# Altium schematic sheet Power.SchDoc: DARKYDEN_POWER
size Letter; ApprovedBy: APPROUVÉ PAR; Author: Harold Malbrouck; Organization: Cegep Limoilou; Address1: 1300, 8e Avenue; Address2: Québec, QC; Address3: Canada; Address4: G1J 5L5; Revision: Rev.A; SheetNumber: 8; SheetTotal: 22
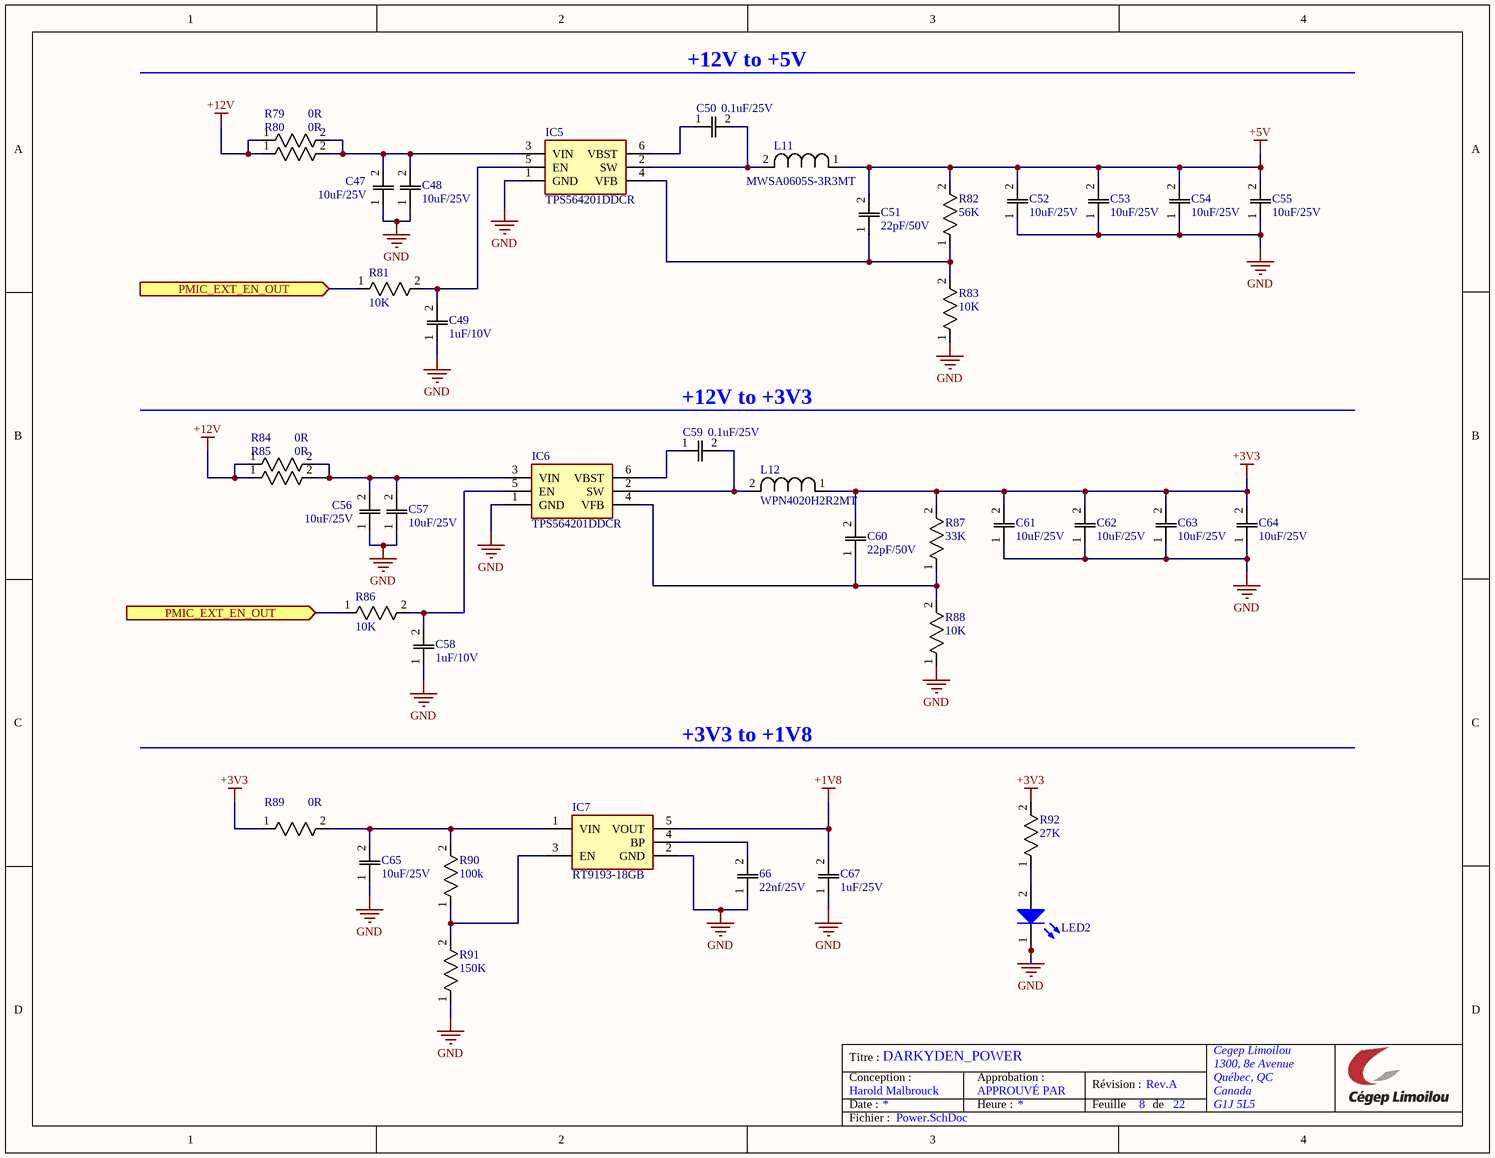
[diagram p0: Power.SchDoc]

## Parts
66  22nf/25V  [C0805]
C47  10uF/25V  [CAPC220145_88N_KEM]
C48  10uF/25V  [CAPC220145_88N_KEM]
C49  1uF/10V  [CAPC220145_88N_KEM]
C50  0.1uF/25V  [CAPC220145_88N_KEM]
C51  22pF/50V  [CAPC220145_88N_KEM]
C52  10uF/25V  [CAPC220145_88N_KEM]
C53  10uF/25V  [CAPC220145_88N_KEM]
C54  10uF/25V  [CAPC220145_88N_KEM]
C55  10uF/25V  [CAPC220145_88N_KEM]
C56  10uF/25V  [CAPC220145_88N_KEM]
C57  10uF/25V  [CAPC220145_88N_KEM]
C58  1uF/10V  [CAPC220145_88N_KEM]
C59  0.1uF/25V  [CAPC220145_88N_KEM]
C60  22pF/50V  [CAPC220145_88N_KEM]
C61  10uF/25V  [CAPC220145_88N_KEM]
C62  10uF/25V  [CAPC220145_88N_KEM]
C63  10uF/25V  [CAPC220145_88N_KEM]
C64  10uF/25V  [CAPC220145_88N_KEM]
C65  10uF/25V  [CAPC220145_88N_KEM]
C67  1uF/25V  [C0805]
IC5  TPS564201DDCR  [SOT95P280X110-6N]
IC6  TPS564201DDCR  [SOT95P280X110-6N]
IC7  RT9193-18GB  [SOT94P279X130-5N]
L11  MWSA0605S-3R3MT  [IND_MWSA0603S_SNL]
L12  WPN4020H2R2MT  [IND_WPN4020H_SNL]
LED2  Blue, 3.2V, 140°  [WL-SMCD_0603]  (value not drawn)
R79  0R  [ERJ3EKF1000V]
R80  0R  [ERJ3EKF1000V]
R81  10K  [ERJ3EKF1000V]
R82  56K  [RESC1608X55N]
R83  10K  [ERJ3EKF1000V]
R84  0R  [ERJ3EKF1000V]
R85  0R  [ERJ3EKF1000V]
R86  10K  [ERJ3EKF1000V]
R87  33K  [ERJ3EKF1000V]
R88  10K  [ERJ3EKF1000V]
R89  0R  [ERJ3EKF1000V]
R90  100k  [ERJ3EKF1000V]
R91  150K  [ERJ3EKF1000V]
R92  27K  [RC0603N_PAN]

## Ports
PMIC_EXT_EN_OUT (in, see CONNECTEUR_1[1B], Power[1A], POWER_PCie[1B], POWER_PCie[1C]), PMIC_EXT_EN_OUT (in, see CONNECTEUR_1[1B], Power[1C], POWER_PCie[1B], POWER_PCie[1C])

## Nets
+1V8: C67.2 IC7.5(VOUT)
+3V3: C60.2 C61.2 C62.2 C63.2 C64.2 L12.1 R87.2 R89.1 R92.2
+5V: C51.2 C52.2 C53.2 C54.2 C55.2 L11.1 R82.2
+12V: R79.1 R80.1 R84.1 R85.1
GND: 66.1 C47.1 C48.1 C49.1 C52.1 C53.1 C54.1 C55.1 C56.1 C57.1 C58.1 C61.1 C62.1 C63.1 C64.1 C65.1 C67.1 IC5.1(GND) IC6.1(GND) IC7.2(GND) LED2.1(K) R83.1 R88.1 R91.1
PMIC_EXT_EN_OUT: R81.1 R86.1 ; port PMIC_EXT_EN_OUT
Net66_2: 66.2 IC7.4(BP)
NetC47_2: C47.2 C48.2 IC5.3(VIN) R79.2 R80.2
NetC49_2: C49.2 IC5.5(EN) R81.2
NetC50_1: C50.1 IC5.6(VBST)
NetC50_2: C50.2 IC5.2(SW) L11.2
NetC51_1: C51.1 IC5.4(VFB) R82.1 R83.2
NetC56_2: C56.2 C57.2 IC6.3(VIN) R84.2 R85.2
NetC58_2: C58.2 IC6.5(EN) R86.2
NetC59_1: C59.1 IC6.6(VBST)
NetC59_2: C59.2 IC6.2(SW) L12.2
NetC60_1: C60.1 IC6.4(VFB) R87.1 R88.2
NetC65_2: C65.2 IC7.1(VIN) R89.2 R90.2
NetIC7_3: IC7.3(EN) R90.1 R91.2
NetLED2_2: LED2.2(A) R92.1

## Notes on the sheet
- +12V to +5V
- (near C59) +12V to +3V3
- +3V3 to +1V8
- Titre :
- Conception :
- Date :
- Approbation :
- Heure :
- Révision :
- Feuille
- de
- Fichier :

## Library data of the parts
66 = C0805C223J3GACTU: 22nF, 25 V, 0805 [2012 Metric], 5%, C0G / NP0; Manufacturer_Name: KEMET; Dielectric Material: 4241ConductorMaterial; Voltage Rating: 25V; Dissipation Factor: 0.1%; Temperature Coefficient: 30ppm/°C; Datasheet Link: https://content.kemet.com/datasheets/KEM_C1003_C0G_SMD.pdf; Height: 1.1mm; Manufacturer_Part_Number: C0805C223J3GACTU; Supplier: Digikey; Supplier Part Number: 399-C0805C223J3GACTUCT-ND; Manufacturer: KEMET; Manufacturer Part Number: C0805C223J3GACTU; RoHS: Yes; Category: Ceramic Capacitors; Mounting Technology: Surface Mount; Case/Package: 0805; Case Code (Imperial): 0805; Case Code (Metric): 2012; Material: 4241ConductorMaterial; Min Operating Temperature: -55°C; Max Operating Temperature: 125°C; Value: 22nF; Tolerance: 5%; Packaging: Tape and Reel; Voltage Rating (DC): 25V; Package Quantity: 4000; Dielectric: C0G; Termination: SMD/SMT; Voltage: 25V; Series: SMD Comm C0G; Construction: Flat; Length: 2mm; Width: 1.2mm; Thickness: 0.039inch; Depth: 1.25mm; Radiation Hardening: No; Reach SVHC Compliant: No; RoHS Compliant: Yes; Lead Free: 5697LeadFree; ComponentLink1URL: http://www.farnell.com/datasheets/2741014.pdf?src-supplier=Farnell; ComponentLink1Description: http://www.farnell.com/datasheets/2741014.pdf?src-supplier=Farnell; ComponentLink2URL: http://components.arrow.com/part/dataview/46124259S8614547N7429?src-supplier=Arrow+Electronics; ComponentLink2Description: http://components.arrow.com/part/dataview/46124259S8614547N7429?src-supplier=Arrow+Electronics; ComponentLink3URL: http://www.mouser.com/ds/2/212/KEM_C1003_C0G_SMD-1101588.pdf?src-supplier=Mouser; ComponentLink3Description: http://www.mouser.com/ds/2/212/KEM_C1003_C0G_SMD-1101588.pdf?src-supplier=Mouser; ComponentLink4URL: http://www.kemet.com/docfinder?Partnumber=C0805C223J3GACTU&src-supplier=Digikey; ComponentLink4Description: http://www.kemet.com/docfinder?Partnumber=C0805C223J3GACTU&src-supplier=Digikey; ComponentLink5URL: http://www.farnell.com/datasheets/2741014.pdf?src-supplier=Newark; ComponentLink5Description: http://www.farnell.com/datasheets/2741014.pdf?src-supplier=Newark; ComponentLink6URL: https://www.verical.com/server-webapp/html/getDatasheet?partID=512137&src-supplier=Verical; ComponentLink6Description: https://www.verical.com/server-webapp/html/getDatasheet?partID=512137&src-supplier=Verical; ComponentLink7URL: http://www.farnell.com/datasheets/2741014.pdf?src-supplier=Element14; ComponentLink7Description: http://www.farnell.com/datasheets/2741014.pdf?src-supplier=Element14; ComponentLink8URL: https://datasheet.octopart.com/C0805C223J3GACTU-KEMET-datasheet-176142324.pdf?src-supplier=Element14; ComponentLink8Description: https://datasheet.octopart.com/C0805C223J3GACTU-KEMET-datasheet-176142324.pdf?src-supplier=Element14; ComponentLink9URL: http://capacitoredge.kemet.com/capedge2/DataSheet?pn=C0805C223J3GACTU&src-supplier=Avnet; ComponentLink9Description: http://capacitoredge.kemet.com/capedge2/DataSheet?pn=C0805C223J3GACTU&src-supplier=Avnet; ComponentLink10URL: https://api.kemet.com/component-edge/download/datasheet/C0805C223J3GACTU.pdf?src-supplier=Digi-Key; ComponentLink10Description: https://api.kemet.com/component-edge/download/datasheet/C0805C223J3GACTU.pdf?src-supplier=Digi-Key; ComponentLink11URL: https://datasheet.octopart.com/C0805C223J3GACTU-Kemet-datasheet-14356739.pdf?src-supplier=Newark; ComponentLink11Description: https://datasheet.octopart.com/C0805C223J3GACTU-Kemet-datasheet-14356739.pdf?src-supplier=Newark; ComponentLink12URL: https://datasheet.octopart.com/C0805C223J3GACTU-KEMET-datasheet-37178240.pdf?src-supplier=Electro+Sonic; ComponentLink12Description: https://datasheet.octopart.com/C0805C223J3GACTU-KEMET-datasheet-37178240.pdf?src-supplier=Electro+Sonic
C47 C48 C52-C57 C61-C65 = C0805C106K3PACTU: 10uF / 25 VDC, +85degC, X5R Dielec, +/-10% | KEMET C0805C106K3PACTU 0805; Dielectric Material: Ceramic; Material: 4241ConductorMaterial; Voltage Rating: 25V; Dissipation Factor: 10%; Mfr_Name: Kemet; Supplier: Digikey; Supplier Part Number: 399-11939-1-ND; Manufacturer: KEMET; Manufacturer Part Number: C0805C106K3PACTU; RoHS: Yes; Category: Ceramic Capacitors; Case/Package: 0805; Case Code (Metric): 2012; Case Code (Imperial): 0805; Min Operating Temperature: -55°C; Max Operating Temperature: 85°C; Dielectric: X5R; Packaging: Cut Tape; Voltage: 25V; Termination: Solder; Tolerance: 10%; Value: 10uF; Series: SMD Comm X5R; Voltage Rating (DC): 25V; Length: 2mm; Height: 1.25mm; Depth: 1.25mm; Reach SVHC Compliant: No; RoHS Compliant: Yes; Lead Free: 5697LeadFree; ComponentLink1URL: http://www.farnell.com/datasheets/2741185.pdf?src-supplier=Farnell; ComponentLink1Description: http://www.farnell.com/datasheets/2741185.pdf?src-supplier=Farnell; ComponentLink2URL: http://www.alliedelec.com/m/d/f3c02ddb98afa3dd1adcb801109671e9.pdf?src-supplier=Allied+Electronics; ComponentLink2Description: http://www.alliedelec.com/m/d/f3c02ddb98afa3dd1adcb801109671e9.pdf?src-supplier=Allied+Electronics; ComponentLink3URL: https://api.kemet.com/component-edge/download/datasheet/C0805C106K3PAC7800.pdf?src-supplier=Digikey; ComponentLink3Description: https://api.kemet.com/component-edge/download/datasheet/C0805C106K3PAC7800.pdf?src-supplier=Digikey; ComponentLink4URL: http://www.kemet.com/Lists/ProductCatalog/Attachments/19/KEM_C1006_X5R_SMD.pdf?src-supplier=Avnet; ComponentLink4Description: http://www.kemet.com/Lists/ProductCatalog/Attachments/19/KEM_C1006_X5R_SMD.pdf?src-supplier=Avnet; ComponentLink5URL: http://www.farnell.com/datasheets/2741185.pdf?src-supplier=Element14; ComponentLink5Description: http://www.farnell.com/datasheets/2741185.pdf?src-supplier=Element14; ComponentLink6URL: http://www.farnell.com/datasheets/2741185.pdf?src-supplier=Newark; ComponentLink6Description: http://www.farnell.com/datasheets/2741185.pdf?src-supplier=Newark; ComponentLink7URL: https://datasheet.octopart.com/C0805C106K3PACTU-Kemet-datasheet-46909776.pdf?src-supplier=Element14; ComponentLink7Description: https://datasheet.octopart.com/C0805C106K3PACTU-Kemet-datasheet-46909776.pdf?src-supplier=Element14
C49 C58 = C0805C105K8RACTU: Multilayer Ceramic Capacitors MLCC - SMD/SMT 10V 1uF X7R 0805 10%; Mfr_Name: Kemet; Material: 4241ConductorMaterial; Dissipation Factor: 5%; Supplier: Digikey; Supplier Part Number: 399-C0805C105K8RACTUCT-ND; Manufacturer: KEMET; Manufacturer Part Number: C0805C105K8RACTU; RoHS: Yes; Category: Ceramic Capacitors; Stock: 113387; Pricing: 1=0.2, 10=0.112, 100=0.0701, 1000=0.04837 (USD); Mounting Technology: Surface Mount; Case/Package: 0805; Pins: 2NUMBER; Case Code (Imperial): 0805; Case Code (Metric): 2012; Dielectric Material: Ceramic; Min Operating Temperature: -55°C; Max Operating Temperature: 125°C; Packaging: Tape and Reel; Tolerance: 10%; Value: 1uF; Dielectric: X7R; Package Quantity: 1; Voltage Rating: 10V; Voltage Rating (DC): 10V; Termination: SMD/SMT; Voltage: 10V; Series: C; Construction: Flat; Length: 2mm; Width: 0.049inch; Height: 0.9mm; Depth: 1.25mm; Thickness: 0.039inch; Lead Pitch: 0.75mm; Radiation Hardening: No; Reach SVHC Compliant: No; RoHS Compliant: Yes; Lead Free: 5697LeadFree; ComponentLink1URL: https://datasheet.ciiva.com/6074/kem-c1002-x7r-smd-6074662.pdf?src-supplier=Farnell; ComponentLink1Description: https://datasheet.ciiva.com/6074/kem-c1002-x7r-smd-6074662.pdf?src-supplier=Farnell; ComponentLink2URL: https://datasheet.ciiva.com/22749/1918693-22749723.pdf?src-supplier=Element14; ComponentLink2Description: https://datasheet.ciiva.com/22749/1918693-22749723.pdf?src-supplier=Element14; ComponentLink3URL: https://datasheet.ciiva.com/46385/1851736-46385656.pdf?src-supplier=Element14; ComponentLink3Description: https://datasheet.ciiva.com/46385/1851736-46385656.pdf?src-supplier=Element14; ComponentLink4URL: https://datasheet.ciiva.com/46443/1851736-46443534.pdf?src-supplier=Element14; ComponentLink4Description: https://datasheet.ciiva.com/46443/1851736-46443534.pdf?src-supplier=Element14
C50 C59 = C0805C104K3RACTU: 0.1uF 25V X7R 10% SMD 0805 125C Plastic T/R; Mfr_Name: Kemet; Material: 4241ConductorMaterial; Value: 100nF; Temperature Coefficient: 30ppm/°C; Supplier: Digikey; Supplier Part Number: 399-C0805C104K3RACTUCT-ND; Manufacturer: KEMET; Manufacturer Part Number: C0805C104K3RACTU; RoHS: Yes; Category: Ceramic Capacitors; Mounting Technology: Surface Mount,PCB; Case/Package: 0805; Pins: 2NUMBER; Case Code (Imperial): 0805; Case Code (Metric): 2012; Min Operating Temperature: -55°C; Max Operating Temperature: 125°C; Packaging: Tape and Reel; Tolerance: 10%; Dielectric: X7R; Termination: SMD/SMT; Package Quantity: 4000; Voltage Rating: 25V; Series: SMD Comm X7R; Voltage Rating (DC): 25V; Construction: Flat; Length: 2mm; Width: 1.2mm; Height: 0.9mm; Depth: 1.25mm; Lead Pitch: 0.75mm; Thickness: 889um; Radiation Hardening: No; RoHS Compliant: Yes; Lead Free: 5697LeadFree; Reach SVHC Compliant: 4186SVHC; ComponentLink1URL: https://datasheet.ciiva.com/7842/kem-c1002-x7r-smd-7842536.pdf?src-supplier=Element14; ComponentLink1Description: https://datasheet.ciiva.com/7842/kem-c1002-x7r-smd-7842536.pdf?src-supplier=Element14; ComponentLink2URL: https://datasheet.ciiva.com/7842/kem-c1002-x7r-smd-7842538.pdf?src-supplier=Element14; ComponentLink2Description: https://datasheet.ciiva.com/7842/kem-c1002-x7r-smd-7842538.pdf?src-supplier=Element14
C51 C60 = C0805C220J5RACTU: Cap Ceramic 22pF 50V X7R 5% Pad SMD 0805 125°C T/R; Mfr_Name: Kemet; Temperature Coefficient: 30ppm/°C; Supplier: Digikey; Supplier Part Number: 399-17625-1-ND; Manufacturer: KEMET; Manufacturer Part Number: C0805C220J5RACTU; RoHS: Yes; Category: Ceramic Capacitors; Stock: 8069; Pricing: 1=0.13, 10=0.072, 100=0.0434, 1000=0.02906 (USD); Case/Package: 0805; Material: Ceramic; Dielectric Material: Ceramic; Min Operating Temperature: -55°C; Max Operating Temperature: 125°C; Value: 22pF; Dielectric: X7R; Voltage Rating: 50V; Voltage Rating (DC): 50V; Height: 880um; RoHS Compliant: Yes; ComponentLink1URL: https://datasheet.octopart.com/C0805C220J5RACTU-KEMET-datasheet-130256537.pdf?src-supplier=Farnell; ComponentLink1Description: https://datasheet.octopart.com/C0805C220J5RACTU-KEMET-datasheet-130256537.pdf?src-supplier=Farnell; ComponentLink2URL: https://datasheet.octopart.com/C0805C220J5RACTU-KEMET-datasheet-170333836.pdf?src-supplier=Newark; ComponentLink2Description: https://datasheet.octopart.com/C0805C220J5RACTU-KEMET-datasheet-170333836.pdf?src-supplier=Newark
C67 = C0805C105K3RACTU: 1 µF, 25 V (DC), ±10 %, SMD 0805, X7R, C0805C105K3RAC7800; Manufacturer_Name: KEMET; Dielectric Material: Ceramic; Material: 4241ConductorMaterial; Value: 1uF; Tolerance: 10%; Voltage: 25V; Datasheet Link: https://content.kemet.com/datasheets/KEM_C1002_X7R_SMD.pdf; Height: 1.1mm; Manufacturer_Part_Number: C0805C105K3RACTU; Mouser Part Number: 80-C0805C105K3R; Mouser Price/Stock: https://www.mouser.co.uk/ProductDetail/KEMET/C0805C105K3RACTU?qs=7V%2FSUxyM1Kfm2X%2FN09twSA%3D%3D; Arrow Part Number: C0805C105K3RACTU; Arrow Price/Stock: https://www.arrow.com/en/products/c0805c105k3ractu/kemet-corporation?region=nac; Supplier: Digikey; Supplier Part Number: 399-C0805C105K3RACTUCT-ND; Manufacturer: KEMET; Manufacturer Part Number: C0805C105K3RACTU; RoHS: Yes; Category: Ceramic Capacitors; Stock: 127373; Pricing: 1=0.61, 10=0.498, 100=0.376, 1000=0.30337 (USD); Mounting Technology: Surface Mount; Case/Package: 0805; Pins: 2; Case Code (Imperial): 0805; Case Code (Metric): 2012; Min Operating Temperature: -55°C; Max Operating Temperature: 125°C; Dielectric: X7R; Packaging: Tape and Reel; Termination: SMD/SMT; Package Quantity: 2500; Voltage Rating: 25V; Voltage Rating (DC): 25V; Series: C; Construction: Flat; Length: 2mm; Width: 0.049inch; Depth: 1.25mm; Thickness: 0.055inch; Radiation Hardening: No; Reach SVHC Compliant: No; RoHS Compliant: Yes
IC5 IC6 = TPS564201DDCR: IC REG BUCK ADJ 4A SOT23 "Buck Switching Regulator IC Positive Adjustable 0.76V 1 Output 4A SOT-23-6 Thin, TSOT-23-6"; Manufacturer_Name: Texas Instruments; Number of Outputs: 1; Min Input Voltage: 4.5V; Max Supply Voltage: 17V; Min Output Voltage: 760mV; Max Output Voltage: 7V; Switching Frequency: 560kHz; Synchronous Rectifier: Yes; Quiescent Current: 400uA; Datasheet Link: http://www.ti.com/lit/gpn/tps564201; Height: 1.1mm; Manufacturer_Part_Number: TPS564201DDCR; Mouser Part Number: 595-TPS564201DDCR; Mouser Price/Stock: https://www.mouser.co.uk/ProductDetail/Texas-Instruments/TPS564201DDCR?qs=zEmsApcVOkUKQpyzRnH%2FcQ%3D%3D; Arrow Part Number: TPS564201DDCR; Arrow Price/Stock: https://www.arrow.com/en/products/tps564201ddcr/texas-instruments?region=nac; Supplier: Digikey; Supplier Part Number: 296-47373-1-ND; Manufacturer: Texas Instruments; Manufacturer Part Number: TPS564201DDCR; RoHS: Yes; Category: Voltage Regulators - Switching; Mounting Technology: Surface Mount; Case/Package: SOT-23-6; Pins: 6; Min Operating Temperature: -40°C; Max Operating Temperature: 125°C; Packaging: Cut Tape; Output Current: 4A; Output Type: Adjustable; Output Configuration: Positive; Series: D-CAP2™; Number of Channels: 1; Length: 2.9mm; Width: 1.6mm; Thickness: 870um; Lead Free: Lead Free; RoHS Compliant: Yes; ComponentLink1URL: http://www.ti.com/lit/ds/symlink/tps564201.pdf?src-supplier=Digikey; ComponentLink1Description: http://www.ti.com/lit/ds/symlink/tps564201.pdf?src-supplier=Digikey; ComponentLink2URL: http://www.ti.com/general/docs/suppproductinfo.tsp?distId=10&amp;gotoUrl=http%3A%2F%2Fwww.ti.com%2Flit%2Fgpn%2Ftps564201&src-supplier=Digikey; ComponentLink2Description: http://www.ti.com/general/docs/suppproductinfo.tsp?distId=10&amp;gotoUrl=http%3A%2F%2Fwww.ti.com%2Flit%2Fgpn%2Ftps564201&src-supplier=Digikey
IC7 = RT9193-18GB: Linear Voltage Regulator IC Positive Fixed 1.8V Output 300mA SOT-23-5; Manufacturer_Name: RICHTEK; Datasheet Link: http://www.richtek.com/assets/product_file/RT9193/DS9193-17.pdf; Height: 1.295mm; Manufacturer_Part_Number: RT9193-18GB; Mouser Part Number: 835-RT9193-18GB; Mouser Price/Stock: https://www.mouser.co.uk/ProductDetail/Richtek/RT9193-18GB?qs=amGC7iS6iy%2Fw9hCsuPB4cg%3D%3D
L11 = MWSA0605S-3R3MT: 3.3 µH Shielded Drum Core, Wirewound Inductor 8.5 A 22mOhm Max Nonstandard; Mfr_Name: Sunlord
L12 = WPN4020H2R2MT: 2.2 µH Shielded Drum Core, Wirewound Inductor 4.3 A 48mOhm Max Nonstandard; Mfr_Name: Sunlord; Type: Fixed Inductors; Supplier: Digikey; Supplier Part Number: 3442-WPN4020H2R2MTCT-ND; Manufacturer: Sunlord; Manufacturer Part Number: WPN4020H2R2MT; RoHS: No; Category: Fixed Inductors
LED2 = BLUE: WL-SMCD Mono-color Chip LED Diffused, SMT, size 0603, Blue, 3.2V, 140°; Manufacturer Part Number: 150060BS55040; Manufacturer: Wurth Elektronik; Case/Size Code: 0603; Chip Technology: InGaN; Dominant Wavelength: 470nm; Luminous Intensity: 80mcd; Peak Wavelength: 465nm; Category: Signal LEDs; Match Code: WL-SMCD; ComponentLink1Description: Website Link; ComponentLink1URL: https://www.we-online.com/redexpert/article/150060BS55040?ad; ComponentLink2Description: Datasheet Link; ComponentLink2URL: https://www.we-online.com/redexpert/spec/150060BS55040?ad; Mount: Surface Mount; Operating Temperature Max: 85°C; Operating Temperature Min: -40°C; Packaging: Tape and Reel; Length: 1.6mm; Width: 0.8mm; Height: 0.4mm; Emitting Color: Blue; Forward Voltage: 3.2V; Viewing Angle: 140°
R79 R80 R84 R85 R89 = ERJ-3GEY0R00V: Zero Ohm Resistor, Jumper, 0603 [1608 Metric], Thick Film, 100 mW, 1 A, Surface Mount; Manufacturer_Name: Panasonic; Power Rating: 100mW; Voltage Rating: 75V; Tolerance: 0%; Temperature Coefficient: 200ppm/°C; Datasheet Link: http://docs-europe.electrocomponents.com/webdocs/13ba/0900766b813ba21b.pdf; Height: 0.55mm; Manufacturer_Part_Number: ERJ-3GEY0R00V; Mouser Part Number: 667-ERJ-3GEY0R00V; Mouser Price/Stock: https://www.mouser.co.uk/ProductDetail/Panasonic/ERJ-3GEY0R00V?qs=66DK8nO8gJALIOqOWgiVwg%3D%3D; Arrow Part Number: ERJ-3GEY0R00V; Arrow Price/Stock: https://www.arrow.com/en/products/erj3gey0r00v/panasonic?region=europe; Supplier: Digikey; Supplier Part Number: P0.0GCT-ND; Manufacturer: Panasonic; Manufacturer Part Number: ERJ-3GEY0R00V; RoHS: Yes; Category: Chip SMD Resistors; Stock: 766631; Pricing: 1=0.1, 10=0.02, 25=0.0164, 50=0.0144, 100=0.0126, 250=0.0106, 500=0.00936, 1000=0.0083 (USD); Mounting Technology: Surface Mount; Case/Package: 0603; Case Code (Metric): 1608; Case Code (Imperial): 0603; Contact Plating: Tin; Min Operating Temperature: -55°C; Max Operating Temperature: 155°C; Packaging: Tape and Reel; Package Quantity: 5000; Value: 0R; Resistor Type: Thick Film; Number of Terminations: 2; Termination: SMD/SMT; Max Power Dissipation: 100mW; Features: Automotive AEC-Q200; Series: ERJ; Construction: Rectangular; Technology: THICK FILM; Length: 1.6mm; Width: 0.8mm; Depth: 0.8mm; Ratings: AEC-Q200; Radiation Hardening: No; Reach SVHC Compliant: No; Military Standard: Not; RoHS Compliant: Yes; Lead Free: 5697LeadFree; ComponentLink1URL: https://datasheet.ciiva.com/11808/0900766b80f806dd-11808207.pdf?src-supplier=Rs; ComponentLink1Description: https://datasheet.ciiva.com/11808/0900766b80f806dd-11808207.pdf?src-supplier=Rs; ComponentLink2URL: https://datasheet.ciiva.com/27055/1935748-27055113.pdf?src-supplier=Jameco; ComponentLink2Description: https://datasheet.ciiva.com/27055/1935748-27055113.pdf?src-supplier=Jameco; ComponentLink3URL: https://datasheet.ciiva.com/5959/1678796-5959707.pdf?src-supplier=Farnell; ComponentLink3Description: https://datasheet.ciiva.com/5959/1678796-5959707.pdf?src-supplier=Farnell; ComponentLink4URL: https://datasheet.ciiva.com/43460/1678796-43460647.pdf?src-supplier=Farnell; ComponentLink4Description: https://datasheet.ciiva.com/43460/1678796-43460647.pdf?src-supplier=Farnell; ComponentLink5URL: https://datasheet.ciiva.com/48532/aoa0000ce1-48532165.pdf?src-supplier=Avnet; ComponentLink5Description: https://datasheet.ciiva.com/48532/aoa0000ce1-48532165.pdf?src-supplier=Avnet; ComponentLink6URL: https://datasheet.ciiva.com/28695/1678796-28695833.pdf?src-supplier=Element14; ComponentLink6Description: https://datasheet.ciiva.com/28695/1678796-28695833.pdf?src-supplier=Element14; ComponentLink7URL: https://datasheet.ciiva.com/16834/aoa0000ce1-16834828.pdf?src-supplier=Future+Electronics; ComponentLink7Description: https://datasheet.ciiva.com/16834/aoa0000ce1-16834828.pdf?src-supplier=Future+Electronics; ComponentLink8URL: https://datasheet.ciiva.com/16758/70255313-16758527.pdf?src-supplier=Allied+Electronics; ComponentLink8Description: https://datasheet.ciiva.com/16758/70255313-16758527.pdf?src-supplier=Allied+Electronics; ComponentLink9URL: https://datasheet.ciiva.com/30199/4aoa0000ce1-30199822.pdf?src-supplier=Onlinecomponents.com; ComponentLink9Description: https://datasheet.ciiva.com/30199/4aoa0000ce1-30199822.pdf?src-supplier=Onlinecomponents.com; ComponentLink10URL: https://datasheet.ciiva.com/46377/1678796-46377868.pdf?src-supplier=Element14; ComponentLink10Description: https://datasheet.ciiva.com/46377/1678796-46377868.pdf?src-supplier=Element14; ComponentLink11URL: https://datasheet.ciiva.com/9198/aoa0000ce1-9198975.pdf?src-supplier=Avnet; ComponentLink11Description: https://datasheet.ciiva.com/9198/aoa0000ce1-9198975.pdf?src-supplier=Avnet
R81 R83 R86 R88 = ERJ-3GEYJ103V: 10K Ohm 5% Res Thick Film 0603  0.1W(1/10W) ±200ppm/C Pad SMD Automotive T/R; Manufacturer_Name: Panasonic; Value: 10kR; Temperature Coefficient: 200ppm/°C; Power Rating: 100mW; Voltage Rating: 75V; Datasheet Link: http://docs-europe.electrocomponents.com/webdocs/13ba/0900766b813ba21b.pdf; Height: 0.55mm; Manufacturer_Part_Number: ERJ-3GEYJ103V; Mouser Part Number: 667-ERJ-3GEYJ103V; Mouser Price/Stock: https://www.mouser.co.uk/ProductDetail/Panasonic/ERJ-3GEYJ103V?qs=66DK8nO8gJBWgc%252B0VNNxzg%3D%3D; Arrow Part Number: ERJ-3GEYJ103V; Arrow Price/Stock: https://www.arrow.com/en/products/erj-3geyj103v/panasonic?region=europe; Supplier: Digikey; Supplier Part Number: P10KGCT-ND; Manufacturer: Panasonic; Manufacturer Part Number: ERJ-3GEYJ103V; RoHS: Yes; Category: Chip SMD Resistors; Stock: 2191587; Pricing: 1=0.1, 10=0.033, 50=0.02, 100=0.0165, 500=0.01096, 1000=0.00939 (USD); Mounting Technology: Surface Mount; Case/Package: 0603; Case Code (Imperial): 0603; Case Code (Metric): 1608; Weight: 7.1E-05oz; Contact Plating: Tin; Min Operating Temperature: -55°C; Max Operating Temperature: 155°C; Tolerance: 5%; Packaging: Tape and Reel; Technology: THICK FILM; Package Quantity: 1; Resistor Type: Thick Film; Termination: SMD/SMT; Number of Terminations: 2; Max Power Dissipation: 100mW; Working Voltage: 75V; Features: Automotive AEC-Q200; Series: ERJ; Construction: Rectangular; Resistance Tolerance: 5%; Length: 1.6mm; Width: 0.8mm; Depth: 0.8mm; Reach SVHC Compliant: No; Military Standard: Not; Lead Free: Lead Free; RoHS Compliant: Yes; ComponentLink1URL: https://datasheet.ciiva.com/11809/0900766b80f806dd-11809566.pdf?src-supplier=Rs; ComponentLink1Description: https://datasheet.ciiva.com/11809/0900766b80f806dd-11809566.pdf?src-supplier=Rs; ComponentLink2URL: https://datasheet.ciiva.com/34303/2007265-34303757.pdf?src-supplier=Jameco; ComponentLink2Description: https://datasheet.ciiva.com/34303/2007265-34303757.pdf?src-supplier=Jameco; ComponentLink3URL: https://datasheet.ciiva.com/48531/aoa0000ce1-48531887.pdf?src-supplier=Avnet; ComponentLink3Description: https://datasheet.ciiva.com/48531/aoa0000ce1-48531887.pdf?src-supplier=Avnet; ComponentLink4URL: https://datasheet.ciiva.com/9117/aoa0000ce1-9117038.pdf?src-supplier=Avnet; ComponentLink4Description: https://datasheet.ciiva.com/9117/aoa0000ce1-9117038.pdf?src-supplier=Avnet; ComponentLink5URL: https://datasheet.ciiva.com/28514/1678796-28514213.pdf?src-supplier=Element14; ComponentLink5Description: https://datasheet.ciiva.com/28514/1678796-28514213.pdf?src-supplier=Element14; ComponentLink6URL: https://datasheet.ciiva.com/46371/1678796-46371909.pdf?src-supplier=Element14; ComponentLink6Description: https://datasheet.ciiva.com/46371/1678796-46371909.pdf?src-supplier=Element14; ComponentLink7URL: https://datasheet.ciiva.com/46385/1678796-46385240.pdf?src-supplier=Element14; ComponentLink7Description: https://datasheet.ciiva.com/46385/1678796-46385240.pdf?src-supplier=Element14; ComponentLink8URL: https://datasheet.ciiva.com/24133/aoa0000ce1-37422-24133064.pdf?src-supplier=Mouser; ComponentLink8Description: https://datasheet.ciiva.com/24133/aoa0000ce1-37422-24133064.pdf?src-supplier=Mouser; ComponentLink9URL: https://datasheet.ciiva.com/16740/aoa0000ce1-16740655.pdf?src-supplier=Future+Electronics; ComponentLink9Description: https://datasheet.ciiva.com/16740/aoa0000ce1-16740655.pdf?src-supplier=Future+Electronics; ComponentLink10URL: https://datasheet.ciiva.com/30147/4aoa0000ce1-30147029.pdf?src-supplier=Onlinecomponents.com; ComponentLink10Description: https://datasheet.ciiva.com/30147/4aoa0000ce1-30147029.pdf?src-supplier=Onlinecomponents.com
R82 = ERJ-3EKF5602V: 56K Ohm 1% 1/10W +/-100ppm/ßC Molded SMD Punched Carrier T/R; Manufacturer_Name: Panasonic; Value: 56kR; Power Rating: 100mW; Voltage Rating: 75V; Temperature Coefficient: 100ppm/°C; Datasheet Link: http://industrial.panasonic.com/cdbs/www-data/pdf/RDA0000/AOA0000C86.pdf; Height: 0.55mm; Manufacturer_Part_Number: ERJ-3EKF5602V; Mouser Part Number: 667-ERJ-3EKF5602V; Mouser Price/Stock: https://www.mouser.com/Search/Refine.aspx?Keyword=667-ERJ-3EKF5602V; Arrow Part Number: ERJ-3EKF5602V; Arrow Price/Stock: https://www.arrow.com/en/products/erj-3ekf5602v/panasonic; Supplier: Digikey; Supplier Part Number: P56.0KHCT-ND; Manufacturer: Panasonic; Manufacturer Part Number: ERJ-3EKF5602V; RoHS: Yes; Category: Chip SMD Resistors; Mounting Technology: Surface Mount; Case/Package: 0603; Pins: 2; Case Code (Imperial): 0603; Case Code (Metric): 1608; Contact Plating: Tin; Min Operating Temperature: -55°C; Max Operating Temperature: 155°C; Packaging: Tape and Reel; Tolerance: 1%; Package Quantity: 1; Termination: SMD/SMT; Resistor Type: Thick Film; Number of Terminations: 2; Max Power Dissipation: 100mW; Voltage Rating (DC): 75V; Features: Automotive AEC-Q200; Series: ERJ; Resistance Tolerance: 1%; Construction: Rectangular; Length: 1.6mm; Width: 0.8mm; Depth: 0.8mm; Radiation Hardening: No; Reach SVHC Compliant: No; Military Standard: Not; Lead Free: Lead Free; RoHS Compliant: Yes; ComponentLink1URL: https://datasheet.ciiva.com/9188/aoa0000ce2-9188742.pdf?src-supplier=Avnet; ComponentLink1Description: https://datasheet.ciiva.com/9188/aoa0000ce2-9188742.pdf?src-supplier=Avnet; ComponentLink2URL: https://datasheet.ciiva.com/48531/aoa0000ce2-48531022.pdf?src-supplier=Avnet; ComponentLink2Description: https://datasheet.ciiva.com/48531/aoa0000ce2-48531022.pdf?src-supplier=Avnet; ComponentLink3URL: https://datasheet.ciiva.com/7886/aoa0000ce2-7886732.pdf?src-supplier=Element14; ComponentLink3Description: https://datasheet.ciiva.com/7886/aoa0000ce2-7886732.pdf?src-supplier=Element14; ComponentLink4URL: https://datasheet.ciiva.com/22684/1678782-22684791.pdf?src-supplier=Element14; ComponentLink4Description: https://datasheet.ciiva.com/22684/1678782-22684791.pdf?src-supplier=Element14; ComponentLink5URL: https://datasheet.ciiva.com/28590/1678782-28590957.pdf?src-supplier=Element14; ComponentLink5Description: https://datasheet.ciiva.com/28590/1678782-28590957.pdf?src-supplier=Element14; ComponentLink6URL: https://datasheet.ciiva.com/46373/1678782-46373897.pdf?src-supplier=Element14; ComponentLink6Description: https://datasheet.ciiva.com/46373/1678782-46373897.pdf?src-supplier=Element14; ComponentLink7URL: https://datasheet.ciiva.com/46373/1678782-46373898.pdf?src-supplier=Element14; ComponentLink7Description: https://datasheet.ciiva.com/46373/1678782-46373898.pdf?src-supplier=Element14; ComponentLink8URL: https://datasheet.ciiva.com/24069/aoa0000ce2-24069910.pdf?src-supplier=Mouser; ComponentLink8Description: https://datasheet.ciiva.com/24069/aoa0000ce2-24069910.pdf?src-supplier=Mouser; ComponentLink9URL: https://datasheet.ciiva.com/16757/70260748-16757718.pdf?src-supplier=Allied+Electronics; ComponentLink9Description: https://datasheet.ciiva.com/16757/70260748-16757718.pdf?src-supplier=Allied+Electronics; ComponentLink10URL: https://datasheet.ciiva.com/16765/70260748-16765709.pdf?src-supplier=Allied+Electronics; ComponentLink10Description: https://datasheet.ciiva.com/16765/70260748-16765709.pdf?src-supplier=Allied+Electronics; ComponentLink11URL: https://datasheet.ciiva.com/30089/aoa0000ce2-30089321.pdf?src-supplier=Onlinecomponents.com; ComponentLink11Description: https://datasheet.ciiva.com/30089/aoa0000ce2-30089321.pdf?src-supplier=Onlinecomponents.com
R87 = ERJ-3GEYJ333V: 33K Ohm 0603  5% 0.1W(1/10W) +/-200ppm/ßC SMD Automotive T/R; Manufacturer_Name: Panasonic; Value: 33kR; Power Rating: 100mW; Voltage Rating: 75V; Temperature Coefficient: 200ppm/°C; Datasheet Link: http://docs-europe.electrocomponents.com/webdocs/13ba/0900766b813ba21b.pdf; Height: 0.55mm; Manufacturer_Part_Number: ERJ-3GEYJ333V; Mouser Part Number: 667-ERJ-3GEYJ333V; Mouser Price/Stock: https://www.mouser.co.uk/ProductDetail/Panasonic/ERJ-3GEYJ333V?qs=JjxTDIFmKPQB8Hd2hIsG7w%3D%3D; Supplier: Avnet; Supplier Part Number: 65T8631; Manufacturer: Panasonic; Manufacturer Part Number: ERJ-3GEYJ333V; RoHS: Yes; Category: Chip SMD Resistors; Mounting Technology: Surface Mount; Case/Package: 0603; Case Code (Metric): 1608; Case Code (Imperial): 0603; Contact Plating: Tin; Min Operating Temperature: -55°C; Max Operating Temperature: 155°C; Tolerance: 5%; Packaging: Tape and Reel; Package Quantity: 1; Resistor Type: Thick Film; Number of Terminations: 2; Termination: SMD/SMT; Max Power Dissipation: 100mW; Features: Automotive AEC-Q200; Series: ERJ; Construction: Rectangular; Technology: THICK FILM; Resistance Tolerance: 5%; Length: 1.6mm; Width: 0.8mm; Depth: 0.8mm; Radiation Hardening: No; Reach SVHC Compliant: No; Military Standard: Not; Lead Free: Lead Free; RoHS Compliant: Yes; ComponentLink1URL: https://datasheet.ciiva.com/11821/0900766b80f806dd-11821443.pdf?src-supplier=Rs; ComponentLink1Description: https://datasheet.ciiva.com/11821/0900766b80f806dd-11821443.pdf?src-supplier=Rs; ComponentLink2URL: https://datasheet.ciiva.com/6082/1500035-6082201.pdf?src-supplier=Farnell; ComponentLink2Description: https://datasheet.ciiva.com/6082/1500035-6082201.pdf?src-supplier=Farnell; ComponentLink3URL: https://datasheet.ciiva.com/43460/1500035-43460750.pdf?src-supplier=Farnell; ComponentLink3Description: https://datasheet.ciiva.com/43460/1500035-43460750.pdf?src-supplier=Farnell; ComponentLink4URL: https://datasheet.ciiva.com/9117/aoa0000ce1-9117178.pdf?src-supplier=Avnet; ComponentLink4Description: https://datasheet.ciiva.com/9117/aoa0000ce1-9117178.pdf?src-supplier=Avnet; ComponentLink5URL: https://datasheet.ciiva.com/16788/70255313-16788733.pdf?src-supplier=Allied+Electronics; ComponentLink5Description: https://datasheet.ciiva.com/16788/70255313-16788733.pdf?src-supplier=Allied+Electronics; ComponentLink6URL: https://datasheet.ciiva.com/30068/4aoa0000ce1-30068957.pdf?src-supplier=Onlinecomponents.com; ComponentLink6Description: https://datasheet.ciiva.com/30068/4aoa0000ce1-30068957.pdf?src-supplier=Onlinecomponents.com; ComponentLink7URL: https://datasheet.ciiva.com/16765/70255313-16765226.pdf?src-supplier=Allied+Electronics; ComponentLink7Description: https://datasheet.ciiva.com/16765/70255313-16765226.pdf?src-supplier=Allied+Electronics; ComponentLink8URL: https://datasheet.ciiva.com/28682/1678796-28682159.pdf?src-supplier=Element14; ComponentLink8Description: https://datasheet.ciiva.com/28682/1678796-28682159.pdf?src-supplier=Element14; ComponentLink9URL: https://datasheet.ciiva.com/46377/1500035-46377061.pdf?src-supplier=Element14; ComponentLink9Description: https://datasheet.ciiva.com/46377/1500035-46377061.pdf?src-supplier=Element14; ComponentLink10URL: https://datasheet.ciiva.com/46388/1500035-46388634.pdf?src-supplier=Element14; ComponentLink10Description: https://datasheet.ciiva.com/46388/1500035-46388634.pdf?src-supplier=Element14
R90 = ERJ-3GEYJ104V: 100K Ohm 5%  Res Thick Film 0603 1/10W +/-200ppm/ßC Molded SMD Punched Carrier T/R; Manufacturer_Name: Panasonic; Value: 100kR; Power Rating: 100mW; Voltage Rating: 75V; Temperature Coefficient: 200ppm/°C; Voltage Rating (DC): 50V; Datasheet Link: http://docs-europe.electrocomponents.com/webdocs/13ba/0900766b813ba21b.pdf; Height: 0.55mm; Manufacturer_Part_Number: ERJ-3GEYJ104V; Mouser Part Number: 667-ERJ-3GEYJ104V; Mouser Price/Stock: https://www.mouser.co.uk/ProductDetail/Panasonic/ERJ-3GEYJ104V?qs=66DK8nO8gJC7IhSuep78kw%3D%3D; Arrow Part Number: ERJ-3GEYJ104V; Arrow Price/Stock: https://www.arrow.com/en/products/erj-3geyj104v/panasonic?region=nac; Supplier: Digikey; Supplier Part Number: P100KGCT-ND; Manufacturer: Panasonic; Manufacturer Part Number: ERJ-3GEYJ104V; RoHS: Yes; Category: Chip SMD Resistors; Stock: 248896; Pricing: 1=0.1, 10=0.033, 50=0.02, 100=0.0165, 500=0.01096, 1000=0.00939 (USD); Mounting Technology: Surface Mount; Case/Package: 0603; Case Code (Imperial): 0603; Case Code (Metric): 1608; Weight: 7.1E-05oz; Contact Plating: Tin; Min Operating Temperature: -55°C; Max Operating Temperature: 155°C; Tolerance: 5%; Packaging: Tape and Reel; Package Quantity: 1; Resistor Type: Thick Film; Termination: SMD/SMT; Number of Terminations: 2; Max Power Dissipation: 100mW; Features: Automotive AEC-Q200; Series: ERJ; Construction: Rectangular; Resistance Tolerance: 5%; Technology: THICK FILM; Length: 1.6mm; Width: 0.8mm; Depth: 0.8mm; Reach SVHC Compliant: No; Military Standard: Not; RoHS Compliant: Yes; ComponentLink1URL: https://datasheet.ciiva.com/11809/0900766b80f806dd-11809567.pdf?src-supplier=Rs; ComponentLink1Description: https://datasheet.ciiva.com/11809/0900766b80f806dd-11809567.pdf?src-supplier=Rs; ComponentLink2URL: https://datasheet.ciiva.com/22758/1678796-22758220.pdf?src-supplier=Farnell; ComponentLink2Description: https://datasheet.ciiva.com/22758/1678796-22758220.pdf?src-supplier=Farnell; ComponentLink3URL: https://datasheet.ciiva.com/43460/1678796-43460761.pdf?src-supplier=Farnell; ComponentLink3Description: https://datasheet.ciiva.com/43460/1678796-43460761.pdf?src-supplier=Farnell; ComponentLink4URL: https://datasheet.ciiva.com/24159/aoa0000ce1-37422-24159717.pdf?src-supplier=Mouser; ComponentLink4Description: https://datasheet.ciiva.com/24159/aoa0000ce1-37422-24159717.pdf?src-supplier=Mouser; ComponentLink5URL: https://datasheet.ciiva.com/46380/1678796-46380412.pdf?src-supplier=Element14; ComponentLink5Description: https://datasheet.ciiva.com/46380/1678796-46380412.pdf?src-supplier=Element14; ComponentLink6URL: https://datasheet.ciiva.com/46389/1678796-46389629.pdf?src-supplier=Element14; ComponentLink6Description: https://datasheet.ciiva.com/46389/1678796-46389629.pdf?src-supplier=Element14; ComponentLink7URL: https://datasheet.ciiva.com/27055/1988495-27055706.pdf?src-supplier=Jameco; ComponentLink7Description: https://datasheet.ciiva.com/27055/1988495-27055706.pdf?src-supplier=Jameco; ComponentLink8URL: https://datasheet.ciiva.com/16762/70255313-16762591.pdf?src-supplier=Allied+Electronics; ComponentLink8Description: https://datasheet.ciiva.com/16762/70255313-16762591.pdf?src-supplier=Allied+Electronics; ComponentLink9URL: https://datasheet.ciiva.com/16508/aoa0000ce1-16508383.pdf?src-supplier=Future+Electronics; ComponentLink9Description: https://datasheet.ciiva.com/16508/aoa0000ce1-16508383.pdf?src-supplier=Future+Electronics
R91 = ERJ-3GEYJ154V: 150 kOhm, ± 5%, 100 mW, 0603 [1608 Metric], Thick Film, General Purpose; Manufacturer_Name: Panasonic; Value: 150kR; Power Rating: 100mW; Voltage Rating: 75V; Temperature Coefficient: 200ppm/°C; Voltage Rating (DC): 50V; Datasheet Link: http://docs-europe.electrocomponents.com/webdocs/13ba/0900766b813ba21b.pdf; Height: 0.55mm; Manufacturer_Part_Number: ERJ-3GEYJ154V; Mouser Part Number: 667-ERJ-3GEYJ154V; Mouser Price/Stock: https://www.mouser.co.uk/ProductDetail/Panasonic/ERJ-3GEYJ154V?qs=JjxTDIFmKPQSZANcYWp2Qw%3D%3D; Arrow Part Number: ERJ-3GEYJ154V; Arrow Price/Stock: https://www.arrow.com/en/products/erj-3geyj154v/panasonic; Supplier: Avnet; Supplier Part Number: 65T8579; Manufacturer: Panasonic; Manufacturer Part Number: ERJ-3GEYJ154V; RoHS: Yes; Category: Chip SMD Resistors; Mounting Technology: Surface Mount; Case/Package: 0603; Case Code (Metric): 1608; Case Code (Imperial): 0603; Contact Plating: Tin; Min Operating Temperature: -55°C; Max Operating Temperature: 155°C; Tolerance: 5%; Packaging: Tape and Reel; Package Quantity: 1; Resistor Type: Thick Film; Number of Terminations: 2; Termination: SMD/SMT; Max Power Dissipation: 100mW; Features: Automotive AEC-Q200; Series: ERJ; Resistance Tolerance: 5%; Construction: Rectangular; Technology: THICK FILM; Length: 1.6mm; Width: 0.8mm; Depth: 0.8mm; Radiation Hardening: No; Reach SVHC Compliant: No; Military Standard: Not; RoHS Compliant: Yes; ComponentLink1URL: https://datasheet.ciiva.com/11821/0900766b80f806dd-11821407.pdf?src-supplier=Rs; ComponentLink1Description: https://datasheet.ciiva.com/11821/0900766b80f806dd-11821407.pdf?src-supplier=Rs; ComponentLink2URL: https://datasheet.ciiva.com/6137/1500035-6137498.pdf?src-supplier=Farnell; ComponentLink2Description: https://datasheet.ciiva.com/6137/1500035-6137498.pdf?src-supplier=Farnell; ComponentLink3URL: https://datasheet.ciiva.com/30195/4aoa0000ce1-30195896.pdf?src-supplier=Onlinecomponents.com; ComponentLink3Description: https://datasheet.ciiva.com/30195/4aoa0000ce1-30195896.pdf?src-supplier=Onlinecomponents.com; ComponentLink4URL: https://datasheet.ciiva.com/43460/1500035-43460765.pdf?src-supplier=Farnell; ComponentLink4Description: https://datasheet.ciiva.com/43460/1500035-43460765.pdf?src-supplier=Farnell; ComponentLink5URL: https://datasheet.ciiva.com/9185/aoa0000ce1-9185511.pdf?src-supplier=Avnet; ComponentLink5Description: https://datasheet.ciiva.com/9185/aoa0000ce1-9185511.pdf?src-supplier=Avnet; ComponentLink6URL: https://datasheet.ciiva.com/9185/aoa0000ce1-9185515.pdf?src-supplier=Avnet; ComponentLink6Description: https://datasheet.ciiva.com/9185/aoa0000ce1-9185515.pdf?src-supplier=Avnet; ComponentLink7URL: https://datasheet.ciiva.com/16768/70255313-16768859.pdf?src-supplier=Allied+Electronics; ComponentLink7Description: https://datasheet.ciiva.com/16768/70255313-16768859.pdf?src-supplier=Allied+Electronics; ComponentLink8URL: https://datasheet.ciiva.com/46443/1500035-46443765.pdf?src-supplier=Element14; ComponentLink8Description: https://datasheet.ciiva.com/46443/1500035-46443765.pdf?src-supplier=Element14; ComponentLink9URL: https://datasheet.ciiva.com/28691/1678796-28691944.pdf?src-supplier=Element14; ComponentLink9Description: https://datasheet.ciiva.com/28691/1678796-28691944.pdf?src-supplier=Element14
R92 = ERJ-3EKF2702V: Res Thick Film 0603 27K Ohm 1% 1/10W ±100ppm/°C Molded SMD Punched Carrier T/R; Mfr_Name: Panasonic; Value: 27kR; Voltage Rating: 75V; Power Rating: 100mW; Supplier: Digikey; Supplier Part Number: P27.0KHCT-ND; Manufacturer: Panasonic; Manufacturer Part Number: ERJ-3EKF2702V; RoHS: Yes; Category: Chip SMD Resistors; Stock: 194466; Pricing: 1=0.1, 10=0.035, 100=0.0177, 1000=0.01014, 2500=0.00847 (USD); Mounting Technology: Surface Mount; Case/Package: 0603; Pins: 2; Case Code (Imperial): 0603; Case Code (Metric): 1608; Weight: 7.1E-05oz; Contact Plating: Tin; Min Operating Temperature: -55°C; Max Operating Temperature: 155°C; Tolerance: 1%; Packaging: Tape and Reel; Package Quantity: 1; Resistor Type: Thick Film; Termination: SMD/SMT; Number of Terminations: 2; Temperature Coefficient: 100ppm/°C; Max Power Dissipation: 100mW; Voltage Rating (DC): 75V; Features: Automotive AEC-Q200; Series: ERJ; Construction: Rectangular; Resistance Tolerance: 1%; Length: 1.6mm; Width: 0.8mm; Height: 0.022inch; Depth: 0.8mm; Radiation Hardening: No; Reach SVHC Compliant: No; Military Standard: Not; Lead Free: Lead Free; RoHS Compliant: Yes; ComponentLink1URL: https://datasheet.ciiva.com/6082/aoa0000ce2-6082174.pdf?src-supplier=Farnell; ComponentLink1Description: https://datasheet.ciiva.com/6082/aoa0000ce2-6082174.pdf?src-supplier=Farnell; ComponentLink2URL: https://datasheet.ciiva.com/9116/aoa0000ce2-9116938.pdf?src-supplier=Avnet; ComponentLink2Description: https://datasheet.ciiva.com/9116/aoa0000ce2-9116938.pdf?src-supplier=Avnet; ComponentLink3URL: https://datasheet.ciiva.com/9191/aoa0000ce2-9191209.pdf?src-supplier=Avnet; ComponentLink3Description: https://datasheet.ciiva.com/9191/aoa0000ce2-9191209.pdf?src-supplier=Avnet; ComponentLink4URL: https://datasheet.ciiva.com/24124/aoa0000ce2-24124345.pdf?src-supplier=Mouser; ComponentLink4Description: https://datasheet.ciiva.com/24124/aoa0000ce2-24124345.pdf?src-supplier=Mouser; ComponentLink5URL: https://datasheet.ciiva.com/46420/1678782-46420331.pdf?src-supplier=Element14; ComponentLink5Description: https://datasheet.ciiva.com/46420/1678782-46420331.pdf?src-supplier=Element14; ComponentLink6URL: https://datasheet.ciiva.com/7886/aoa0000ce2-7886728.pdf?src-supplier=Element14; ComponentLink6Description: https://datasheet.ciiva.com/7886/aoa0000ce2-7886728.pdf?src-supplier=Element14; ComponentLink7URL: https://datasheet.ciiva.com/16765/70260748-16765016.pdf?src-supplier=Allied+Electronics; ComponentLink7Description: https://datasheet.ciiva.com/16765/70260748-16765016.pdf?src-supplier=Allied+Electronics; ComponentLink8URL: https://datasheet.ciiva.com/16785/70260748-16785821.pdf?src-supplier=Allied+Electronics; ComponentLink8Description: https://datasheet.ciiva.com/16785/70260748-16785821.pdf?src-supplier=Allied+Electronics